# Altium schematic sheet pic_mcu.SchDoc
size A; SheetNumber: 1; SheetTotal: 2
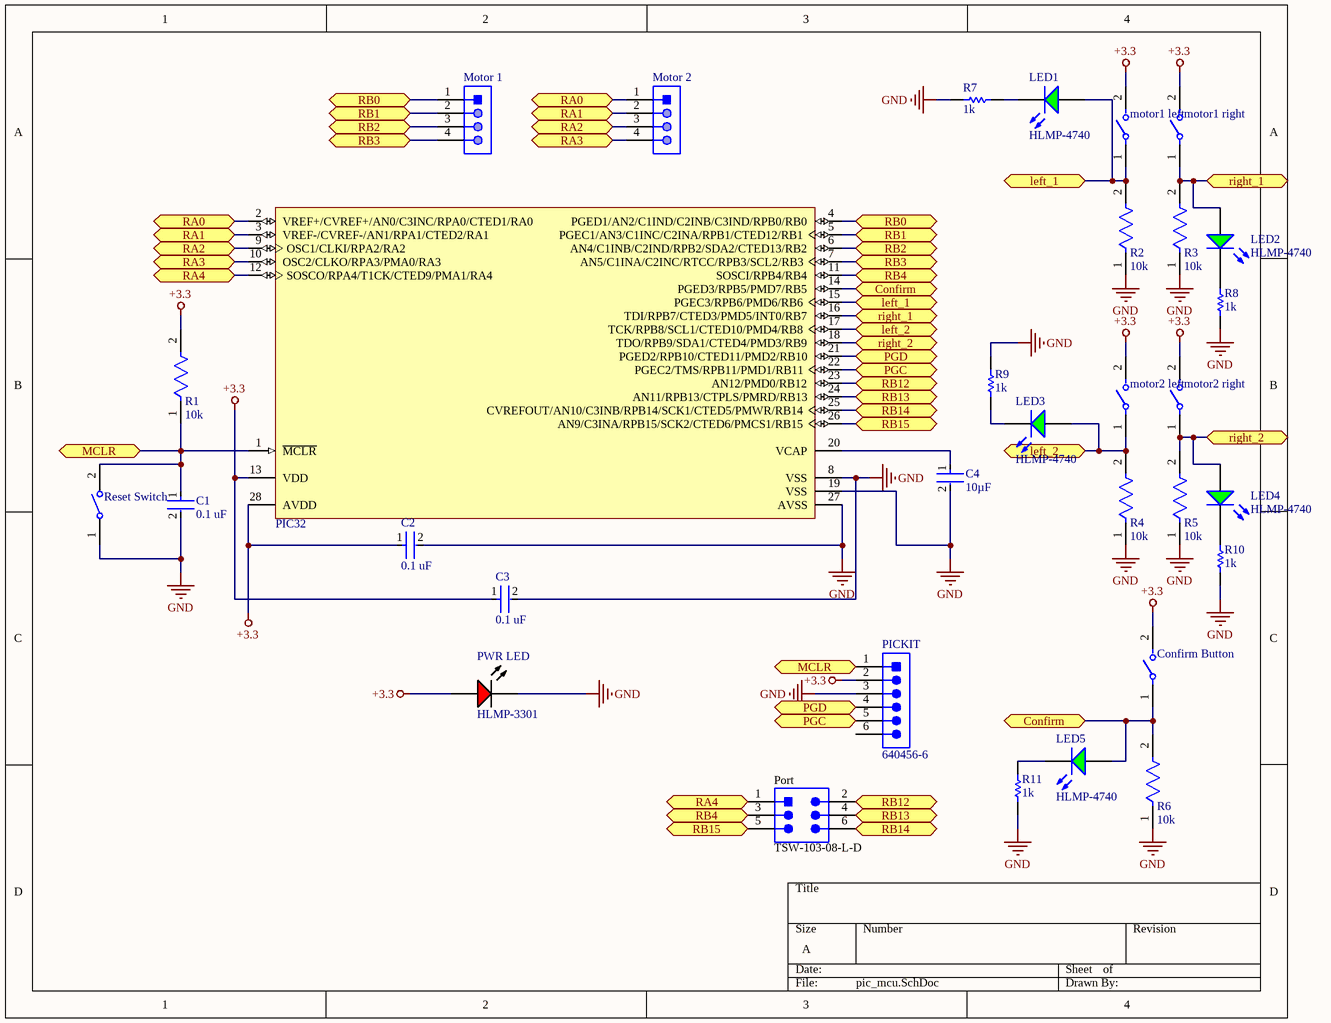
[diagram p0: pic_mcu.SchDoc]

## Parts
C1  0.1 uF  [FP-C0603C-CF-MFG]
C2  0.1 uF  [FP-C0603C-CF-MFG]
C3  0.1 uF  [FP-C0603C-CF-MFG]
C4  10µF  [FP-GRM188-0_1-e0_2_0_55-MFG]
Confirm_Button  FSM4JRT  [FP-FSM4JRT-MFG]  (value not drawn)
LED1  HLMP-4740  [AVAG-HLMP-4740]
LED2  HLMP-4740  [AVAG-HLMP-4740]
LED3  HLMP-4740  [AVAG-HLMP-4740]
LED4  HLMP-4740  [AVAG-HLMP-4740]
LED5  HLMP-4740  [AVAG-HLMP-4740]
motor1_left  FSM4JRT  [FP-FSM4JRT-MFG]  (value not drawn)
motor1_right  FSM4JRT  [FP-FSM4JRT-MFG]  (value not drawn)
motor2_left  FSM4JRT  [FP-FSM4JRT-MFG]  (value not drawn)
motor2_right  FSM4JRT  [FP-FSM4JRT-MFG]  (value not drawn)
Motor_1  691322110004  [691322110004]  (value not drawn)
Motor_2  691322110004  [691322110004]  (value not drawn)
PIC32  PIC32MX150F128B-I/SP  [MCHP-SPDIP-SP28]  (value not drawn)
PICKIT  640456-6  [TECO-640456-6_V]
Port  TSW-103-08-L-D  [SMTC-TSW-103-08-L-D_V]
PWR_LED  HLMP-3301  [AVAG-HLMP-3301-2]
R1  10k  [FP-RC0603-0_55-IPC_C]
R2  10k  [FP-RC0603-0_55-IPC_C]
R3  10k  [FP-RC0603-0_55-IPC_C]
R4  10k  [FP-RC0603-0_55-IPC_C]
R5  10k  [FP-RC0603-0_55-IPC_C]
R6  10k  [FP-RC0603-0_55-IPC_C]
R7  1k  [RESA60-630X240]
R8  1k  [RESA60-630X240]
R9  1k  [RESA60-630X240]
R10  1k  [RESA60-630X240]
R11  1k  [RESA60-630X240]
Reset_Switch  (no value)  [TECO-FSMSM-2_V]

## Ports
Confirm (bidir), left_1 (bidir), left_2 (bidir), MCLR (bidir), PGC (bidir), PGD (bidir), RA0 (bidir), RA1 (bidir), RA2 (bidir), RA3 (bidir), RA4 (bidir), RB0 (bidir), RB1 (bidir), RB2 (bidir), RB3 (bidir), RB4 (bidir), RB12 (bidir), RB13 (bidir), RB14 (bidir), RB15 (bidir), right_1 (bidir), right_2 (bidir)

## Nets
+3.3: C2.1 C3.1 Confirm_Button.2 motor1_left.2 motor1_right.2 motor2_left.2 motor2_right.2 PIC32.13(VDD) PIC32.28(AVDD) PICKIT.2 PWR_LED.2(A) R1.2
GND: C1.2 C2.2 C3.2 C4.2 PIC32.8(VSS) PIC32.19(VSS) PIC32.27(AVSS) PICKIT.3 PWR_LED.1(K) R2.1 R3.1 R4.1 R5.1 R6.1 R7.1 R8.1 R9.1 R10.1 R11.1 Reset_Switch.1
Confirm: Confirm_Button.1 LED5.1(A) PIC32.14(PGED3/RPB5/PMD7/RB5) R6.2 ; port Confirm
left_1: LED1.1(A) motor1_left.1 PIC32.15(PGEC3/RPB6/PMD6/RB6) R2.2 ; port left_1
left_2: LED3.1(A) motor2_left.1 PIC32.17(TCK/RPB8/SCL1/CTED10/PMD4/RB8) R4.2 ; port left_2
MCLR: C1.1 PIC32.1(~{MCLR}) PICKIT.1 R1.1 Reset_Switch.2 ; port MCLR
PGC: PIC32.22(PGEC2/TMS/RPB11/PMD1/RB11) PICKIT.5 ; port PGC
PGD: PIC32.21(PGED2/RPB10/CTED11/PMD2/RB10) PICKIT.4 ; port PGD
RA0: Motor_2.1 PIC32.2(VREF+/CVREF+/AN0/C3INC/RPA0/CTED1/RA0) ; port RA0
RA1: Motor_2.2 PIC32.3(VREF-/CVREF-/AN1/RPA1/CTED2/RA1) ; port RA1
RA2: Motor_2.3 PIC32.9(OSC1/CLKI/RPA2/RA2) ; port RA2
RA3: Motor_2.4 PIC32.10(OSC2/CLKO/RPA3/PMA0/RA3) ; port RA3
RA4: PIC32.12(SOSCO/RPA4/T1CK/CTED9/PMA1/RA4) Port.1 ; port RA4
RB0: Motor_1.1 PIC32.4(PGED1/AN2/C1IND/C2INB/C3IND/RPB0/RB0) ; port RB0
RB1: Motor_1.2 PIC32.5(PGEC1/AN3/C1INC/C2INA/RPB1/CTED12/RB1) ; port RB1
RB2: Motor_1.3 PIC32.6(AN4/C1INB/C2IND/RPB2/SDA2/CTED13/RB2) ; port RB2
RB3: Motor_1.4 PIC32.7(AN5/C1INA/C2INC/RTCC/RPB3/SCL2/RB3) ; port RB3
RB4: PIC32.11(SOSCI/RPB4/RB4) Port.3 ; port RB4
RB12: PIC32.23(AN12/PMD0/RB12) Port.2 ; port RB12
RB13: PIC32.24(AN11/RPB13/CTPLS/PMRD/RB13) Port.4 ; port RB13
RB14: PIC32.25(CVREFOUT/AN10/C3INB/RPB14/SCK1/CTED5/PMWR/RB14) Port.6 ; port RB14
RB15: PIC32.26(AN9/C3INA/RPB15/SCK2/CTED6/PMCS1/RB15) Port.5 ; port RB15
right_1: LED2.1(A) motor1_right.1 PIC32.16(TDI/RPB7/CTED3/PMD5/INT0/RB7) R3.2 ; port right_1
right_2: LED4.1(A) motor2_right.1 PIC32.18(TDO/RPB9/SDA1/CTED4/PMD3/RB9) R5.2 ; port right_2
NetC4_1: C4.1 PIC32.20(VCAP)
NetLED1_2: LED1.2(K) R7.2
NetLED2_2: LED2.2(K) R8.2
NetLED3_2: LED3.2(K) R9.2
NetLED4_2: LED4.2(K) R10.2
NetLED5_2: LED5.2(K) R11.2

Not connected (* = marked no-connect by the designer): PICKIT 6

## Library data of the parts
C1-C3 = CMP-2006-03061-2: CAP CER 0.1UF 50V X7R 0603C0603C104K5RACTU; Manufacturer: KEMET; Tolerance: 0.1; Temperature Coefficient: 30ppm/°C; Material: Ceramic; Automotive Grade: Grade 1; Value: 0.10 μF; Temperature: -55°C to +125°C; RoHS: TRUE; Temperature Range High: +125°C; Lead Free: Yes; Octopart: https://octopart.com/c0603c104k5ractu-kemet-139244; Digikey Description: CAP CER 0.1UF 50V X7R 0603; Category: Cap; Package: C0603C-CF; ComponentLink2Description: Datasheet; Temperature Range Low: -55°C; Device Class L1: Passive Components; Voltage Rating: 50 V; Automotive: Yes; Device Class L3: Ceramic Capacitors; ComponentLink2URL: https://api.kemet.com/component-edge/download/datasheet/C0603C100J5GACAUTO.pdf; Capacitance: 0.10 μF; Device Class L2: Capacitors; Manufacturer Part Number: C0603C104K5RACTU; Temperature Characteristic: X7R; Height: 0.87mm
C4 = CMP-2006-02793-3: Chip Multilayer Ceramic Capacitors for General Purpose, 0603, 10uF, X5R, 15%, 20%, 6.3V / GRM188R60J106ME47J; Packaging: Tape and Reel; Max Operating Temperature: 85°C; Voltage Rating: 6.3V; Voltage Rating (DC): 6.3V; Voltage: 6.3V; Package Quantity: 10000; Width: 0.8mm; Min Operating Temperature: -55°C; Capacitance: 10uF; Tolerance: 20%; REACH SVHC: No SVHC; Termination: SMD/SMT; Radiation Hardening: No; Lead Free: Lead Free; Dielectric: X5R; Depth: 0.8mm; Mount: Surface Mount; Case Code (Imperial): 0603; Height: 0.8mm; Thickness: 0.035inch; Length: 1.6mm; Case Code (Metric): 1608; Case/Package: 0603
Confirm_Button motor1_left motor1_right motor2_left motor2_right = CMP-03407-000038-1: SWITCH TACTILE SPST-NO 0.05A 24V; Current Rating: 50mA; Actuator Diameter: 3.5mm; Max Voltage Rating (DC): 12V; Actuator Length: 0.055inch; Switch Travel: 0.25mm; Actuator Type: Standard; Contact Resistance: 100mR; Illumination Type: Non-Illuminated; Electrical Life: 100000Cycles; Throw Configuration: SPST; Switch Function: Off-Mom; Actuator Material: Resin; Operating Force: 1.57N; Series: FSMJRT; Min Operating Temperature: -35°C; Max Current Rating: 50mA; Termination: PC Pins; Type: Switch; Radiation Hardening: No; Max Operating Temperature: 105°C; Voltage Rating (DC): 12V; Contact Material: Copper Alloy; Contact Current Rating: 50mA; RoHS Compliant: Yes; Mechanical Life: 100000Cycles; Mount: Through Hole; Package Quantity: 10000; Case/Package: Radial; Packaging: Tape and Reel; Length: 6.19mm; Contact Plating: Silver; Depth: 6.19mm; Orientation: Straight
LED1-LED5 = CMP-2000-06413-1: T-1 3/4 (5 mm) Low Current LED Lamp, Green, 1.9 V, -20 to 100 degC, 2-Pin THD, RoHS, Bulk; Manufacturer: AvagoTechnologies; Type: Uni-Color; Peak Wavelength: 565nm; Rad Hard: No; Viewing Angle: 50°; Dominant Wavelength/Color Temperature: 569nm; Number of LEDs: 1; Lens Appearance: ColoredDiffused; Lens Shape Type: Circular; Mounting Orientation: TopMount; Intensity: 2.3mcd; Datasheet Version: 07/2014; Category: LEDs; Datasheet URL: http://docs.avagotech.com/docs/AV02-1557EN; Packaging: Bulk; Pin Count: 2; Mounting Technology: ThroughHole; Package Reference: HLMP-4740; Mounting: ThroughHole; Manufacturer URL: http://www.avagotech.com/; Color: Green; Package: 2T-13/4; Package Description: 2-Pin Through Hole Device, Dia 5.845 mm, Pitch 2.54 mm
Motor_1 Motor_2 = CMP-1502-01793-1: Serie 3221 - 3.50mm Horizontal PCB Header WR-TBL, 4 pin; Manufacturer: Wurth Elektronik; Pin Number: 4; Gender: Male; Part Number: 691322110004; Pitch: 3.50mm; Package Reference: 691322110004; Packaging: Box; Operating Temperature: -40to105degC; Manufacturer URL: http://www.we-online.de; Datasheet URL: http://katalog.we-online.de/em/datasheet/6913221100xx.pdf; Publisher: WurthElektronik; Mounting Technology: THT
PIC32 = CMP-0048-00469-1: 32-bit Microcontroller with Audio and Graphics Interface, USB and Advanced Analog, 50 MHz, 21 I/O, PMP, -40 to 85 degC, 28-pin SPDIP (SP28), Tube; Manufacturer: Microchip; DatasheetVersion: Rev. E; ComponentLink1URL: http://www.microchip.com; ComponentLink3URL: http://www.microchip.com/stellent/groups/techpub_sg/documents/packagingspec/en012702.pdf; ComponentLink4URL: http://www.microchip.com/PIC32MX150F128B; PartNumber: PIC32MX150F128B-I/SP; ComponentLink3Description: Package Specification; ComponentLink2URL: http://ww1.microchip.com/downloads/en/DeviceDoc/61168E.pdf; ComponentLink2Description: Datasheet; PackageDescription: 28-Lead Plastic Dual In-Line, 34.86 x 6.79 mm Body, 2.54 mm Pitch; ComponentLink1Description: Manufacturer URL; PackageReference: SPDIP-SP28; PackageVersion: C04-070B; ComponentLink4Description: Product URL; Mounting Technology: Through Hole
PICKIT = CMP-2000-05661-1: Male Header, Pitch 2.54 mm, 1 x 6 Position, Height 10.03 mm, Tail Length 3.56 mm, -55 to 105 degC, Bulk; Manufacturer: TE Connectivity; Contact Centerline Spacing: 0.100 / in.; Number of Contacts: 6; Current, Rating: 5 / A; Agency Approvals: CSA,UL; Material, Contact: CopperAlloy; Mounting Hole Size: 0.04 / "; Brand/Series: MTA-100Series; Pin Spacing: 0.1 / "; Mount Angle: Vertical; Contact Termination Area Plating: Tin; Angle: Straight; Primary Type: InterconnectSystem; Standards: RoHSCompliant,ELVCompliant,UL94V-0; Temperature, Operating: -55to+105 / °C; Material, Housing: Polyester; Special Features: Pinstrip; Color, Housing: White; Connector Type: MTA-100; Voltage, Rating: 250 / V; Termination: Solder; Package Reference: 640456-6; Size, Post: 0.025 / in.; Color: White; Datasheet URL: https://datasheet.ciiva.com/25618/0900766b80eb7fdd-25618163.pdf; Manufacturer URL: http://www.te.com/; Mounting Type: PCMount; Length, Pin: 0.14 / "; Type: PCBPlug; Length, Overall: 0.6 / "; Mounting Technology: ThroughHole; Number of Rows: 1; Contact Shape: Square; Contact Mating Area Plating: Tin; Datasheet Version: Rev. W, 05/2005; Number of Positions: 6; Package Description: Male Header, Pitch 2.54 mm, 1 x 6 Position, Height 10.03 mm, Tail Length 3.56 mm; Contact Plating: Tin; Length, Terminal Post: 0.14 / in.; Flammability Rating: UL94V-0
Port = CMP-1024-00336-5: Male Header, Pitch 2.54 mm, 2 x 3 Position, Height 8.38 mm, Tail Length 5.08 mm, -55 to 125 degC, RoHS, Bulk; Manufacturer: Samtec; DatasheetVersion: 04/2012; ComponentLink3URL: http://suddendocs.samtec.com/prints/tsw-xxx-xx-x-x-xx-xxx-footprint.pdf; PackageReference: TSW-103-08-L-D; Mounting Technology: Through Hole; Min Operating Temperature: -55 degC; ComponentLink2Description: Datasheet; Lead Pitch: 2.54 mm; ComponentLink1Description: Manufacturer URL; Mount: Through Hole; ComponentLink1URL: http://www.samtec.com/; ComponentLink3Description: Package Specification; Max Operating Temperature: 125 degC; PackageDescription: Male Header, Pitch 2.54 mm, 2 x 3 Position, Height 8.38 mm, Tail Length 5.08 mm; ComponentLink2URL: https://datasheet.ciiva.com/25618/0900766b81154476-25618436.pdf; RoHSCompliant: true
PWR_LED = CMP-2000-06411-1: T-1 3/4 (5 mm) Diffused LED Lamp, 1.9 V, -40 to 100 degC, 2-Pin THD, RoHS, Bulk; Manufacturer: Avago; Forward Current: 25mA; Forward Voltage: 2.4V; Peak Wavelength: 635nm; Shape Type: Circular; High Brightness: No; Main Category: StandardLED; Test Current (It): 10mA; Dominant Wave Length: 626nm; Number of  Elements: 1; Reverse Voltage: 5V; Chip Material: GaP; Product Height (mm): 9.19mm; Lens Type: ColoredDiffused; Viewing Angle: 60deg; Emitting Color: Red; Luminous Intensity: 5.4mcd; Power Dissipation: 85W; DELETED: Compliant; Product Depth (mm): 6.1mm; Package Description: 2-Pin Through Hole LED, Dia 5.85 mm; Mounting Technology: ThroughHole; Manufacturer URL: http://www.avagotech.com/; Package Type: T-13/4; Operating Temp Range: -40Cto100C; Datasheet URL: http://www.avagotech.com/docs/AV02-1558EN; Mounting: ThroughHole; Lens Dimensions: 5.08x5.08x8.3mm; Package Reference: HLMP-3301; Datasheet Version: 03/2015; Pin Count: 2; Packaging: TapeandReel; Type: Uni-Color; Operating Temperature Classification: Industrial; Lum Intensity: 5.4mcd; Rad Hardened: No; Product Length (mm): 6.1mm
R1-R6 = CMP-2100-03664-2: RES 10K OHM 1% 1/10W 0603 / RC0603FR-0710KL; Temperature Coefficient: 100ppm/°C; Resistance: 10kR; Voltage Rating: 75V; Power Rating: 100mW; Voltage Rating (DC): 50V; Height: 0.45mm; Lead Free: Lead Free; Case Code (Metric): 1608; Case/Package: 0603; Depth: 0.8mm; Case Code (Imperial): 0603; Packaging: Tape and Reel; Termination: SMD/SMT; Lead Pitch: 0.3mm; Width: 0.8mm; Number of Pins: 2; Length: 1.6mm; Military Standard: Not; Max Operating Temperature: 155°C; Min Operating Temperature: -55°C; Weight: 7.1E-05oz; Tolerance: 1%; Resistor Type: Thick Film; Series: RC; Construction: Rectangular; Features: Moisture Resistant; Number of Terminations: 2; RoHS Compliant: Yes; Resistance Tolerance: 1%; Max Power Dissipation: 100mW; Size Code: 0603
R7-R11 = CMP-1659-00075-1: Axial Resistor, 1 KOhm, +/- 1%, 250 mW, -55 to 155 degC, 2-Pin THD, RoHS, Bulk / MFR-25FBF52-1K; Voltage Rating: 250 V; Resistance: 10 kohm; Power Rating: 250 mW; ComponentLink2Description: Datasheet; RoHSCompliant: true; PackageReference: MFR-25; Case\Package: Axial; Max Operating Temperature: 155 degC; DatasheetVersion: Apr-13; Tolerance: 1%; ComponentLink1URL: http://www.yageo.com/; Length: 0.248 inch; ComponentLink2URL: http://www.yageo.com/documents/recent/Yageo%20LR_MFR_2013.pdf; Packaging: Bulk; Package Quantity: 200; PackageDescription: 2-Pin Axial Lead, Dia 2.4 mm, Body Length 6.3 mm; Min Operating Temperature: -55 degC; ComponentLink1Description: Manufacturer URL
Reset_Switch = CMP-2000-07511-1: FSMSM Push Button Switch, 50 mA, -35 to 85 degC, 2-Pin SMD, RoHS, Bulk / FSMSM; Manufacturer: TE Connectivity; Actuator Length: 1.07mm; Electrical Life: 20000Cycles; Actuator Material: Polyamide; Current Rating: 50mA; Illumination Type: Illuminated; Voltage Rating (DC): 24V; Contact Resistance: 100mOhm; Case\/Package: SMD/SMT; Operating Force: 180gf; Switch Travel: 0.25mm; Max Voltage Rating (DC): 12V; Throw Configuration: SPST; Packaging: LoosePiece; Max Operating Temperature: 85degC; ELV: Compliant; Package Description: 2-Pin Surface Mount Device, Body 6 x 3.5 mm, Pitch 9.19 mm; RoHSCompliant: true; Manufacturer URL: http://www.te.com/; Contact Plating: Silver; Contact Material: Brass; Mounting Technology: SurfaceMount; Contact Current Rating: 50mA; Datasheet Version: Rev. C2, 08/2014; Datasheet URL: http://www.te.com/commerce/DocumentDelivery/DDEController?Action=showdoc&DocId=Customer+Drawing%7F1437566-3%7FC2%7Fpdf%7FEnglish%7FENG_CD_1437566-3_C2_1437566_3_1_c.dwg.pdf%7F1437566-3; Mechanical Life: 20000Cycles; Package Reference: FSMSM; REACH SVHC: Unknown; Orientation: Straight; Min Operating Temperature: -35degC; Lead Free: LeadFree; Termination: GullWing; Package Quantity: 1000; Mount: SurfaceMount